# Altium project PCB_Project1.PrjPCB
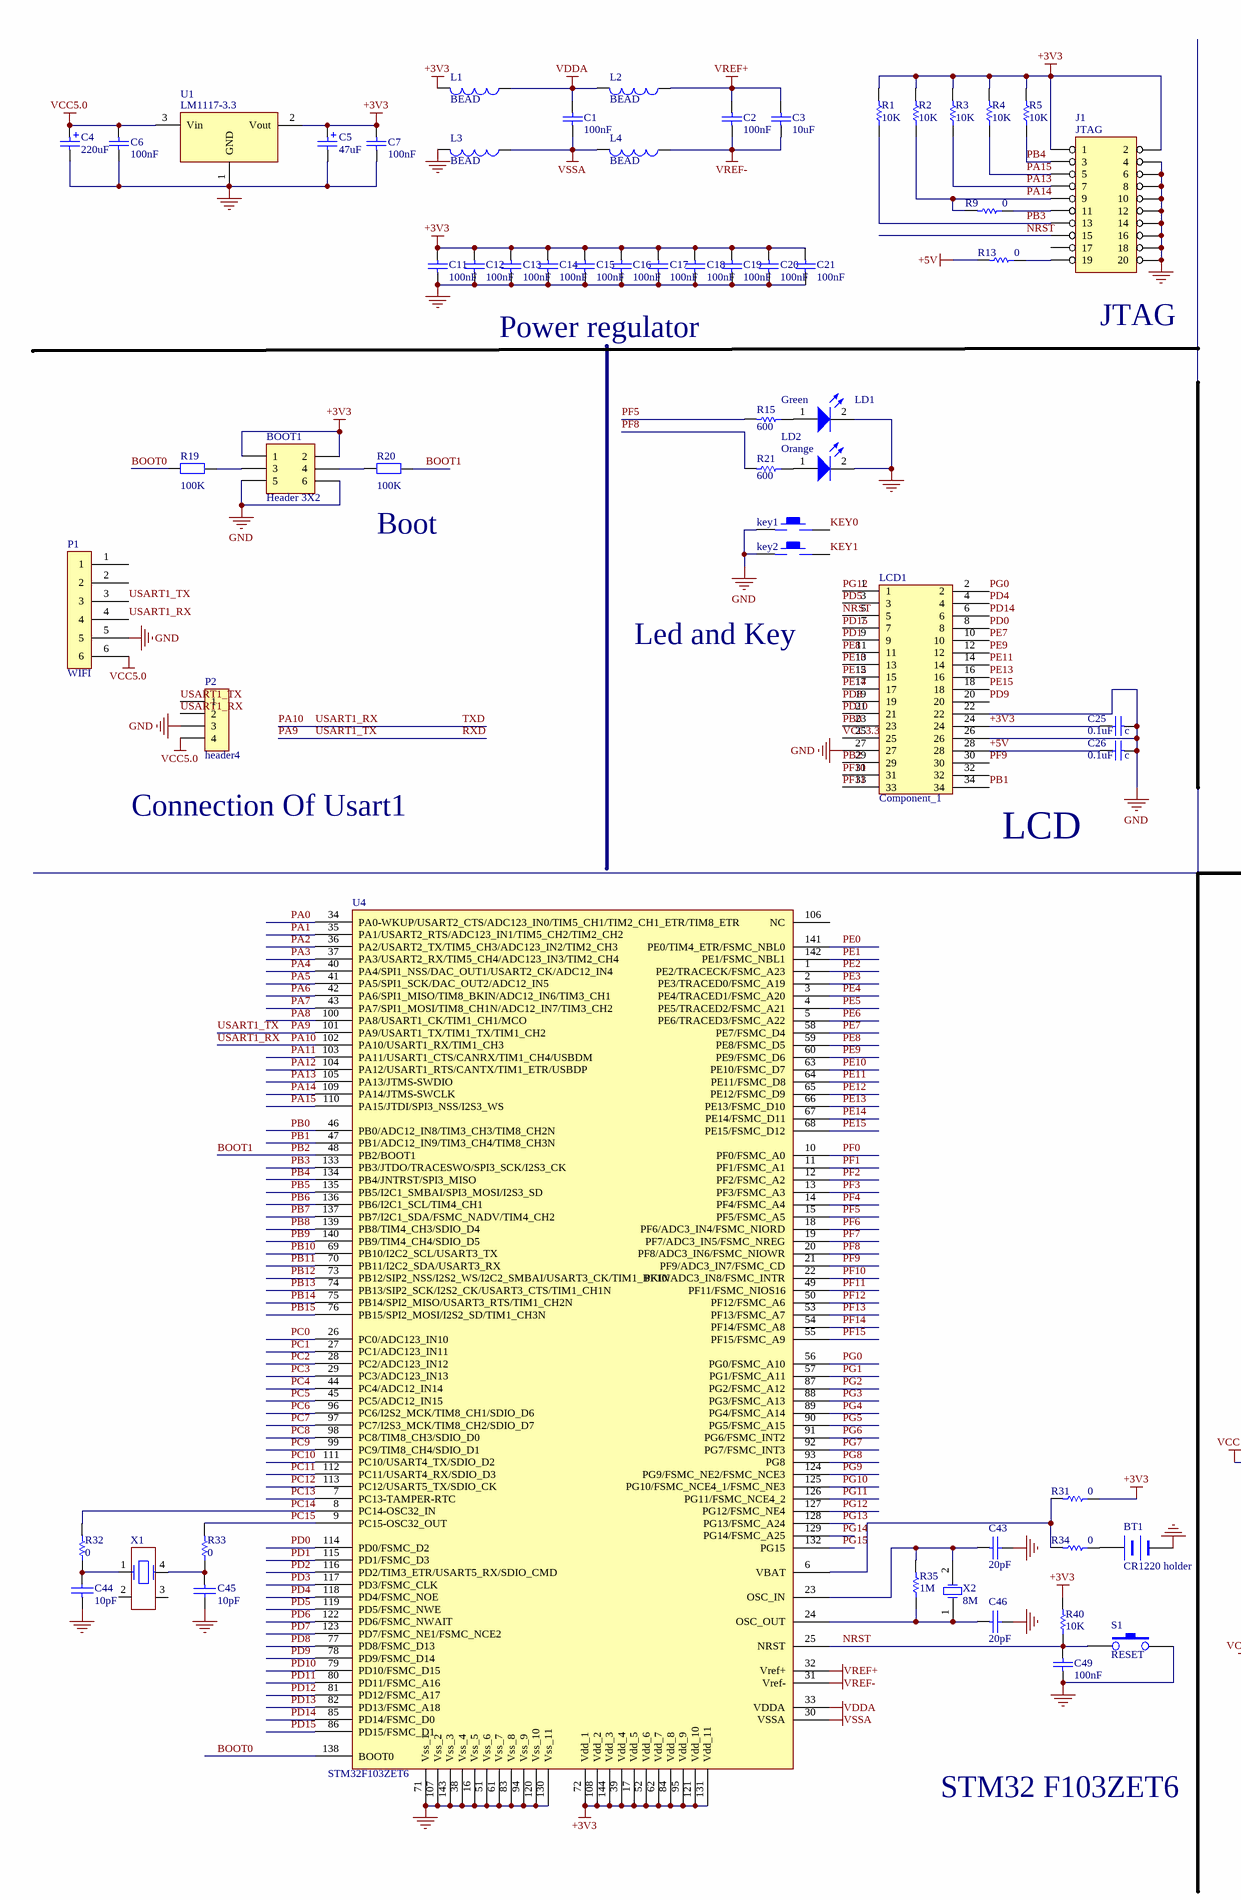
[diagram p0: STM32F103ZET6.SCHDOC, left]
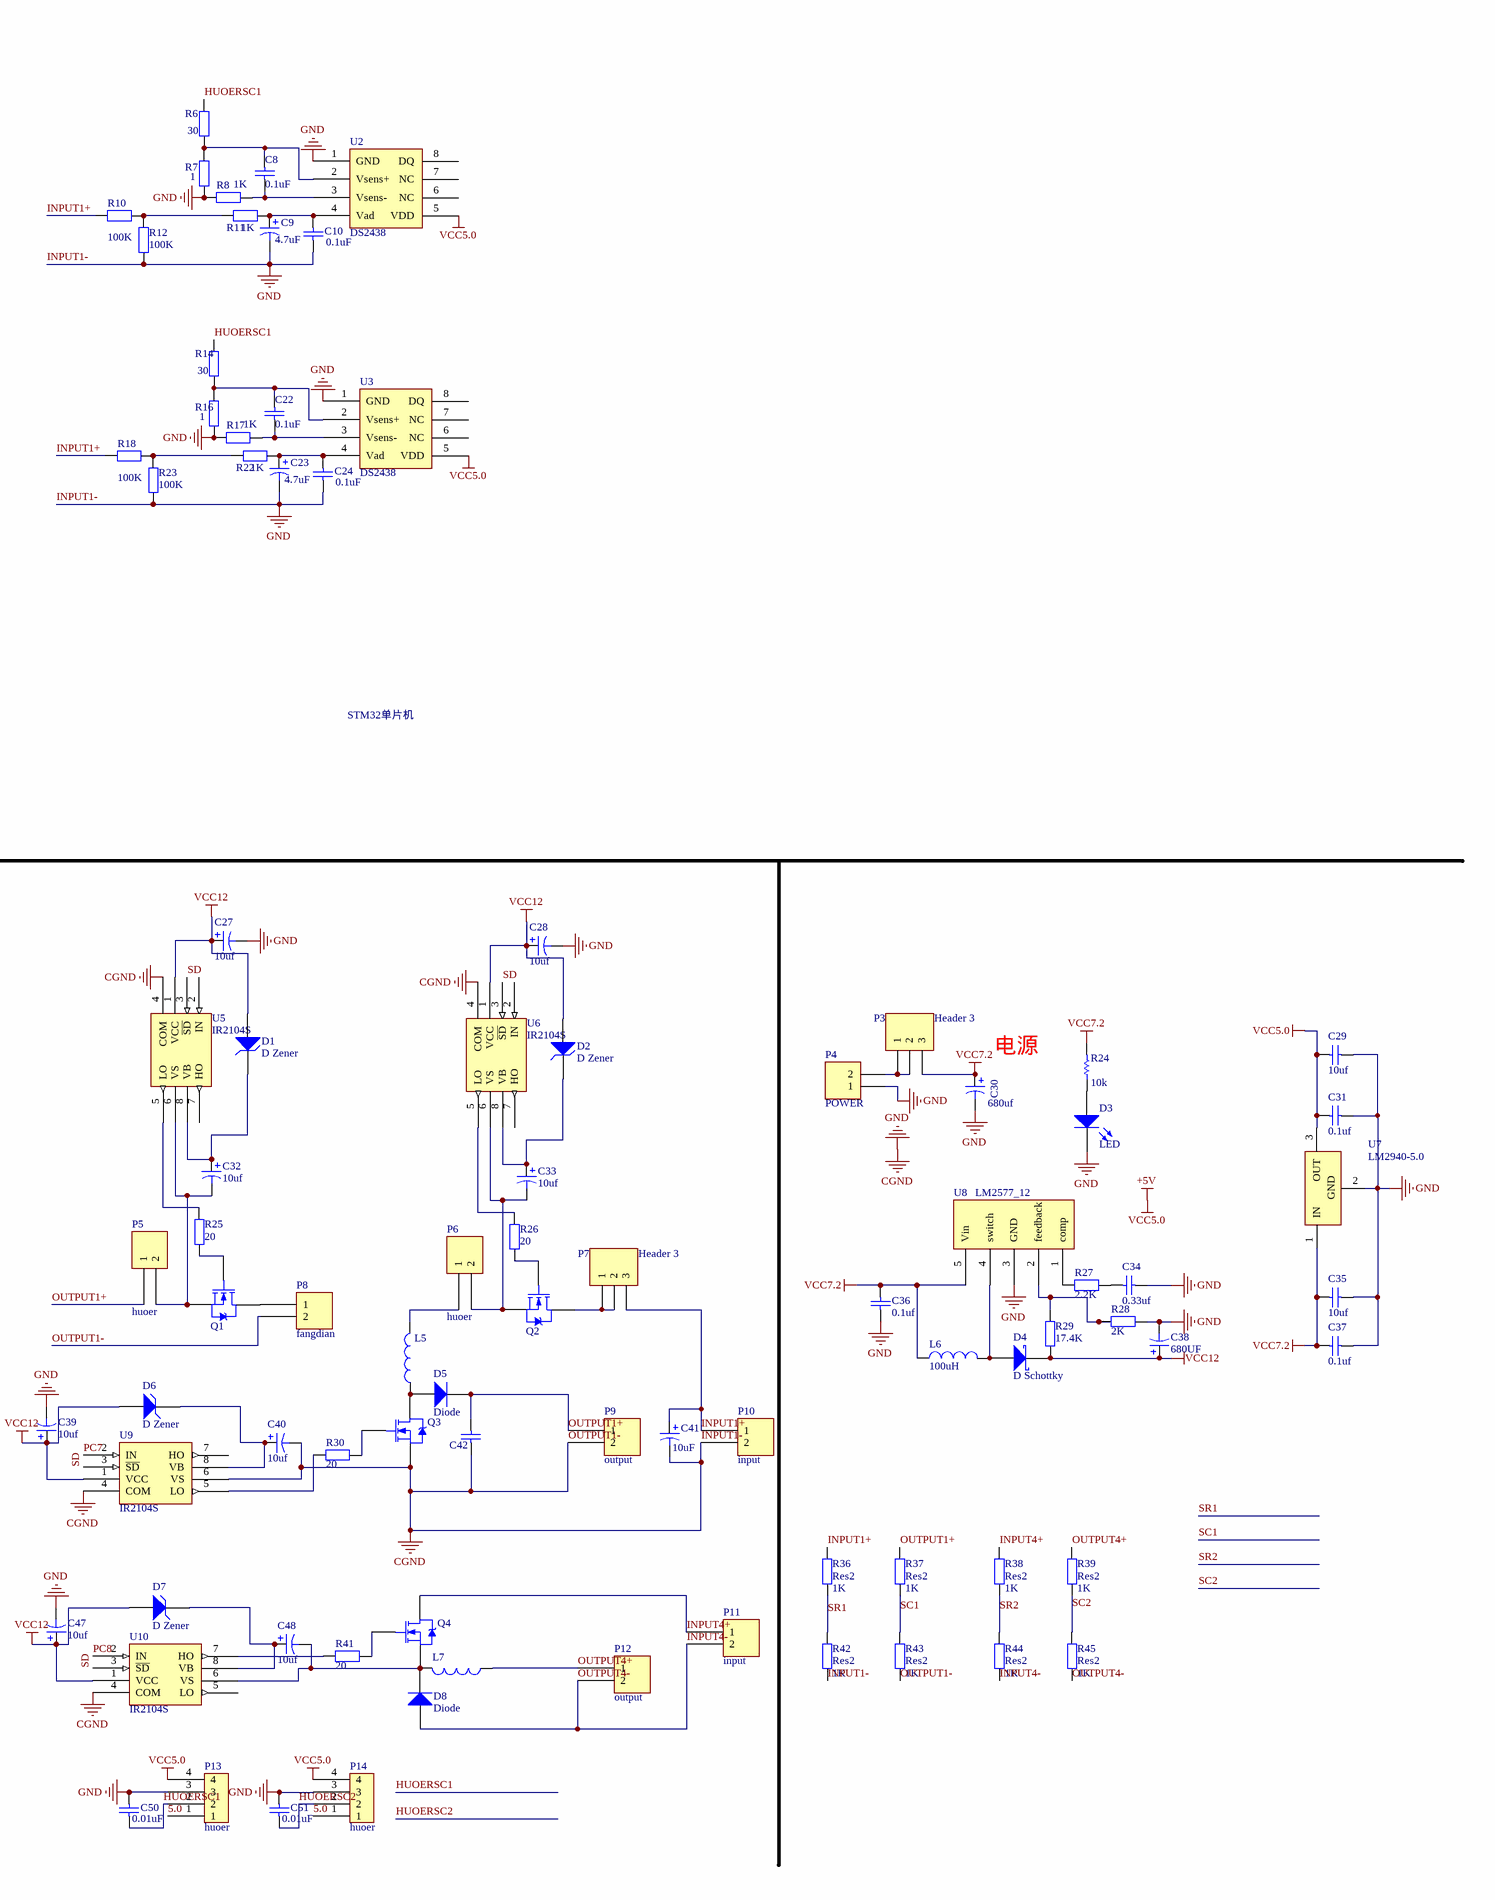
[diagram p1: STM32F103ZET6.SCHDOC, right]
1 sheet, 150 parts. Net scope: global (net labels, ports and power ports of the same name join across sheets).
Board file: STM32F103ZET6.PCBDOC

## Sheet STM32F103ZET6.SCHDOC
size A2

### Parts
BOOT1  Header 3X2  [HDR2X3]
BT1  CR1220 holder  [BAT]
C1  100nF  [0805C]
C2  100nF  [0805C]
C3  10uF  [0805C]
C4  220uF  [0805C]
C5  47uF  [0805C]
C6  100nF  [0805C]
C7  100nF  [0805C]
C8  value 0.1uF  [0805C]
C9  value 4.7uF  [0805C]
C10  value 0.1uF  [0805C]
C11  100nF  [0805C]
C12  100nF  [0805C]
C13  100nF  [0805C]
C14  100nF  [0805C]
C15  100nF  [0805C]
C16  100nF  [0805C]
C17  100nF  [0805C]
C18  100nF  [0805C]
C19  100nF  [0805C]
C20  100nF  [0805C]
C21  100nF  [0805C]
C22  value 0.1uF  [0805C]
C23  value 4.7uF  [0805C]
C24  value 0.1uF  [0805C]
C25  c  value 0.1uF  [0805C]
C26  c  value 0.1uF  [0805C]
C27  value 10uf  [0805C]  (hidden comment: Cap Pol3)
C28  value 10uf  [0805C]  (hidden comment: Cap Pol3)
C29  value 10uf  [0805C]  (hidden comment: Cap)
C30  value 680uf  [cap]  (hidden comment: Cap Pol1)
C31  value 0.1uf  [0805C]  (hidden comment: Cap)
C32  value 10uf  [0805C]  (hidden comment: Cap Pol3)
C33  value 10uf  [0805C]  (hidden comment: Cap Pol3)
C34  value 0.33uf  [0805C]  (hidden comment: Cap Semi)
C35  value 10uf  [0805C]  (hidden comment: Cap)
C36  value 0.1uf  [0805C]  (hidden comment: Cap Semi)
C37  value 0.1uf  [0805C]  (hidden comment: Cap)
C38  value 680UF  [cap]  (hidden comment: Cap Pol3)
C39  value 10uf  [0805C]  (hidden comment: Cap Pol3)
C40  value 10uf  [0805C]  (hidden comment: Cap Pol3)
C41  value 10uF  [0805C]
C42  (no value)  [cap]
C43  20pF  [0805C]
C44  10pF  [0805C]
C45  10pF  [0805C]
C46  20pF  [0805C]
C47  value 10uf  [0805C]  (hidden comment: Cap Pol3)
C48  value 10uf  [0805C]  (hidden comment: Cap Pol3)
C49  100nF  [0805C]
C50  value 0.01uF  [0805C]
C51  value 0.01uF  [0805C]
D1  D Zener  [SMB]
D2  D Zener  [SMB]
D3  LED  [0805D]
D4  D Schottky  [SMB]
D5  Diode  [SMB]
D6  D Zener  [SMB]
D7  D Zener  [SMB]
D8  Diode  [SMB]
J1  JTAG  [JTAG_20PIN]
key1  KEY_M  [key_2pin]  (value not drawn)
key2  KEY_M  [key_2pin]  (value not drawn)
L1  BEAD  [0805R]
L2  BEAD  [0805R]
L3  BEAD  [0805R]
L4  BEAD  [0805R]
L5  (no value)  [L1]
L6  value 100uH  [L1]  (hidden comment: Inductor)
L7  (no value)  [L1]
LCD1  Component_1  [LCD]
LD1  Green  [0805D]
LD2  Orange  [0805D]
P1  WIFI  [wifi]
P2  header4  [HEADER4-PS]
P3  Header 3  [header3-power]
P4  POWER  [dianji]
P5  huoer  [huoer1]
P6  huoer  [huoer1]
P7  Header 3  [header3-power]
P8  fangdian  [duanzi2-5mm]
P9  output  [duanzi2-5mm]
P10  input  [duanzi2-5mm]
P11  input  [duanzi2-5mm]
P12  output  [duanzi2-5mm]
P13  huoer  [huoer]
P14  huoer  [huoer]
Q1  AOD4184  [mos3205]  (value not drawn)
Q2  AOD4184  [mos3205]  (value not drawn)
Q3  AOD4184  [mos3205]  (value not drawn)
Q4  AOD4184  [mos3205]  (value not drawn)
R1  10K  [0805R]
R2  10K  [0805R]
R3  10K  [0805R]
R4  10K  [0805R]
R5  10K  [0805R]
R6  value 30  [0805R]
R7  value 1  [0805R]
R8  value 1K  [0805R]
R9  0  [0805R]
R10  value 100K  [0805R]
R11  value 1K  [0805R]
R12  value 100K  [0805R]
R13  0  [0805R]
R14  value 30  [0805R]
R15  600  [0805R]
R16  value 1  [0805R]
R17  value 1K  [0805R]
R18  value 100K  [0805R]
R19  value 100K  [0805R]  (hidden comment: Res2)
R20  value 100K  [0805R]  (hidden comment: Res2)
R21  600  [0805R]
R22  value 1K  [0805R]
R23  value 100K  [0805R]
R24  value 10k  [0805R]  (hidden comment: Res1)
R25  value 20  [0805R]  (hidden comment: Res2)
R26  value 20  [0805R]  (hidden comment: Res2)
R27  value 2.2K  [0805R]  (hidden comment: Res2)
R28  value 2K  [0805R]  (hidden comment: Res2)
R29  value 17.4K  [0805R]  (hidden comment: Res2)
R30  value 20  [0805R]  (hidden comment: Res2)
R31  0  [0805R]
R32  0  [0805R]
R33  0  [0805R]
R34  0  [0805R]
R35  1M  [0805R]
R36  Res2  value 1K  [0805R]
R37  Res2  value 1K  [0805R]
R38  Res2  value 1K  [0805R]
R39  Res2  value 1K  [0805R]
R40  10K  [0805R]
R41  value 20  [0805R]  (hidden comment: Res2)
R42  Res2  value 1K  [0805R]
R43  Res2  value 1K  [0805R]
R44  Res2  value 1K  [0805R]
R45  Res2  value 1K  [0805R]
S1  RESET  [key_2pin]
U1  LM1117-3.3  [1117]
U2  DS2438  [SOIC_8]
U3  DS2438  [SOIC_8]
U4  STM32F103ZET6  [TQFP144-B]
U5  IR2104S  [SOIC_8]
U6  IR2104S  [SOIC_8]
U7  LM2940-5.0  [TS3B_N]
U8  LM2577_12  [TS5B_N]
U9  IR2104S  [SOIC_8]
U10  IR2104S  [SOIC_8]
X1  MC306-G-06Q-32.768 (manufacturer JFVNY)  [SM8]  (value not drawn)
X2  8M  [XTAL_US]

### Nets
+3V3: BOOT1.1 BOOT1.2 C5.1 C7.1 C11.1 C12.1 C13.1 C14.1 C15.1 C16.1 C17.1 C18.1 C19.1 C20.1 C21.1 C25.1 J1.1 J1.2 L1.2 LCD1.24 R1.2 R2.2 R3.2 R4.2 R5.2 R31.1 R40.2 U1.2(Vout) U4.17(Vdd_5) U4.39(Vdd_4) U4.52(Vdd_6) U4.62(Vdd_7) U4.72(Vdd_1) U4.84(Vdd_8) U4.95(Vdd_9) U4.108(Vdd_2) U4.121(Vdd_10) U4.131(Vdd_11) U4.144(Vdd_3)
+5V: C4.1 C6.1 C26.1 C29.2 C31.2 LCD1.28 P1.6 P2.4 P13.4 P14.4 R13.2 U1.3(Vin) U2.5(VDD) U3.5(VDD) U7.3(OUT)  [also labelled VCC5.0]
INPUT1-: BOOT1.5 BOOT1.6 BT1.2(-) C4.2 C5.2 C6.2 C7.2 C9.2 C10.1 C11.2 C12.2 C13.2 C14.2 C15.2 C16.2 C17.2 C18.2 C19.2 C20.2 C21.2 C23.2 C24.1 C25.2 C26.2 C27.2 C28.2 C29.1 C30.2 C31.1 C34.1 C35.1 C36.1 C37.1 C38.2 C39.2 C40.2 C41.2 C42.1 C43.2 C44.1 C45.2 C46.2 C47.2 C49.1 C50.2 C51.2 D3.2(K) J1.4 J1.6 J1.8 J1.10 J1.12 J1.14 J1.16 J1.18 J1.20 key1.1 key2.1 L3.2 LCD1.22 LCD1.26 LCD1.27 LD1.2(K) LD2.2(K) P1.5 P2.3 P4.1 P8.2 P9.2 P10.2 P13.3 P14.3 Q3.3(S) R7.1 R8.1 R12.1 R16.1 R17.1 R23.1 R28.2 R42.1 R43.1 S1.2 U1.1(GND) U2.1(GND) U3.1(GND) U4.16(Vss_5) U4.38(Vss_4) U4.51(Vss_6) U4.61(Vss_7) U4.71(Vss_1) U4.83(Vss_8) U4.94(Vss_9) U4.107(Vss_2) U4.120(Vss_10) U4.130(Vss_11) U4.143(Vss_3) U5.4(COM) U6.4(COM) U7.2(GND) U8.3(GND) U9.4(COM) U9.6(VS) U10.4(COM)  [also labelled CGND, GND, OUTPUT1-]
VCC7.2: C30.1 C35.2 C36.2 C37.2 L6.1 P3.3 R24.2 U7.1(IN) U8.5(Vin)
VCC12: C27.1 C28.1 C38.1 C39.1 C47.1 D1.1(A) D2.1(A) D4.2(K) D6.1(A) D7.1(A) R29.1 U5.1(VCC) U6.1(VCC) U9.1(VCC) U10.1(VCC)
VDDA: C1.1 L1.1 L2.2 U4.33(VDDA)
VREF+: C2.1 C3.1 L2.1 U4.32(Vref+)
VREF-: C2.2 C3.2 L4.1 U4.31(Vref-)
VSSA: C1.2 L3.1 L4.2 U4.30(VSSA)
5.0: P13.1 P14.1
BOOT0: R19.1 U4.138(BOOT0)
BOOT1: LCD1.29 R20.2 U4.48(PB2/BOOT1)  [also labelled PB2]
HUOERSC1: C50.1 P13.2 R6.2 R14.2
HUOERSC2: C51.1 P14.2
INPUT1+: C41.1 P7.3 P10.1 R10.2 R18.2 R36.2
INPUT4+: P11.1 Q4.2(D) R38.2
INPUT4-: D8.1(A) P11.2 P12.2 R44.1 R45.1  [also labelled OUTPUT4-]
KEY0: key1.2
KEY1: key2.2
NRST: C49.2 J1.15 LCD1.5 R40.1 S1.1 U4.25(NRST)
OUTPUT1+: C42.2 D5.2(K) P5.1 P9.1 R37.2
OUTPUT4+: L7.1 P12.1 R39.2
PA0: U4.34(PA0-WKUP/USART2_CTS/ADC123_IN0/TIM5_CH1/TIM2_CH1_ETR/TIM8_ETR)
PA1: U4.35(PA1/USART2_RTS/ADC123_IN1/TIM5_CH2/TIM2_CH2)
PA2: U4.36(PA2/USART2_TX/TIM5_CH3/ADC123_IN2/TIM2_CH3)
PA3: U4.37(PA3/USART2_RX/TIM5_CH4/ADC123_IN3/TIM2_CH4)
PA4: U4.40(PA4/SPI1_NSS/DAC_OUT1/USART2_CK/ADC12_IN4)
PA5: U4.41(PA5/SPI1_SCK/DAC_OUT2/ADC12_IN5)
PA6: U4.42(PA6/SPI1_MISO/TIM8_BKIN/ADC12_IN6/TIM3_CH1)
PA7: U4.43(PA7/SPI1_MOSI/TIM8_CH1N/ADC12_IN7/TIM3_CH2)
PA8: U4.100(PA8/USART1_CK/TIM1_CH1/MCO)
PA9: P1.3 P2.1 U4.101(PA9/USART1_TX/TIM1_TX/TIM1_CH2)  [also labelled RXD, USART1_TX]
PA10: P1.4 P2.2 U4.102(PA10/USART1_RX/TIM1_CH3)  [also labelled TXD, USART1_RX]
PA11: U4.103(PA11/USART1_CTS/CANRX/TIM1_CH4/USBDM)
PA12: U4.104(PA12/USART1_RTS/CANTX/TIM1_ETR/USBDP)
PA13: J1.7 R3.1 U4.105(PA13/JTMS-SWDIO)
PA14: J1.9 R2.1 R9.2 U4.109(PA14/JTMS-SWCLK)
PA15: J1.5 R4.1 U4.110(PA15/JTDI/SPI3_NSS/I2S3_WS)
PB0: LCD1.23 U4.46(PB0/ADC12_IN8/TIM3_CH3/TIM8_CH2N)
PB1: LCD1.34 U4.47(PB1/ADC12_IN9/TIM3_CH4/TIM8_CH3N)
PB3: J1.13 R1.1 U4.133(PB3/JTDO/TRACESWO/SPI3_SCK/I2S3_CK)
PB4: J1.3 R5.1 U4.134(PB4/JNTRST/SPI3_MISO)
PB5: U4.135(PB5/I2C1_SMBAI/SPI3_MOSI/I2S3_SD)
PB6: U4.136(PB6/I2C1_SCL/TIM4_CH1)
PB7: U4.137(PB7/I2C1_SDA/FSMC_NADV/TIM4_CH2)
PB8: U4.139(PB8/TIM4_CH3/SDIO_D4)
PB9: U4.140(PB9/TIM4_CH4/SDIO_D5)
PB10: U4.69(PB10/I2C2_SCL/USART3_TX)
PB11: U4.70(PB11/I2C2_SDA/USART3_RX)
PB12: U4.73(PB12/SIP2_NSS/I2S2_WS/I2C2_SMBAI/USART3_CK/TIM1_BKIN)
PB13: U4.74(PB13/SIP2_SCK/I2S2_CK/USART3_CTS/TIM1_CH1N)
PB14: U4.75(PB14/SPI2_MISO/USART3_RTS/TIM1_CH2N)
PB15: U4.76(PB15/SPI2_MOSI/I2S2_SD/TIM1_CH3N)
PC0: U4.26(PC0/ADC123_IN10)
PC1: U4.27(PC1/ADC123_IN11)
PC2: U4.28(PC2/ADC123_IN12)
PC3: U4.29(PC3/ADC123_IN13)
PC4: U4.44(PC4/ADC12_IN14)
PC5: U4.45(PC5/ADC12_IN15)
PC6: U4.96(PC6/I2S2_MCK/TIM8_CH1/SDIO_D6)
PC7: U4.97(PC7/I2S3_MCK/TIM8_CH2/SDIO_D7) U9.2(IN)
PC8: U4.98(PC8/TIM8_CH3/SDIO_D0) U10.2(IN)
PC9: U4.99(PC9/TIM8_CH4/SDIO_D1)
PC10: U4.111(PC10/USART4_TX/SDIO_D2)
PC11: U4.112(PC11/USART4_RX/SDIO_D3)
PC12: U4.113(PC12/USART5_TX/SDIO_CK)
PC13: U4.7(PC13-TAMPER-RTC)
PC14: R32.2 U4.8(PC14-OSC32_IN)
PC15: R33.2 U4.9(PC15-OSC32_OUT)
PD0: LCD1.8 U4.114(PD0/FSMC_D2)
PD1: LCD1.9 U4.115(PD1/FSMC_D3)
PD2: U4.116(PD2/TIM3_ETR/USART5_RX/SDIO_CMD)
PD3: U4.117(PD3/FSMC_CLK)
PD4: LCD1.4 U4.118(PD4/FSMC_NOE)
PD5: LCD1.3 U4.119(PD5/FSMC_NWE)
PD6: U4.122(PD6/FSMC_NWAIT)
PD7: U4.123(PD7/FSMC_NE1/FSMC_NCE2)
PD8: LCD1.19 U4.77(PD8/FSMC_D13)
PD9: LCD1.20 U4.78(PD9/FSMC_D14)
PD10: LCD1.21 U4.79(PD10/FSMC_D15)
PD11: U4.80(PD11/FSMC_A16)
PD12: U4.81(PD12/FSMC_A17)
PD13: U4.82(PD13/FSMC_A18)
PD14: LCD1.6 U4.85(PD14/FSMC_D0)
PD15: LCD1.7 U4.86(PD15/FSMC_D1)
PE0: U4.141(PE0/TIM4_ETR/FSMC_NBL0)
PE1: U4.142(PE1/FSMC_NBL1)
PE2: U4.1(PE2/TRACECK/FSMC_A23)
PE3: U4.2(PE3/TRACED0/FSMC_A19)
PE4: U4.3(PE4/TRACED1/FSMC_A20)
PE5: U4.4(PE5/TRACED2/FSMC_A21)
PE6: U4.5(PE6/TRACED3/FSMC_A22)
PE7: LCD1.10 U4.58(PE7/FSMC_D4)
PE8: LCD1.11 U4.59(PE8/FSMC_D5)
PE9: LCD1.12 U4.60(PE9/FSMC_D6)
PE10: LCD1.13 U4.63(PE10/FSMC_D7)
PE11: LCD1.14 U4.64(PE11/FSMC_D8)
PE12: LCD1.15 U4.65(PE12/FSMC_D9)
PE13: LCD1.16 U4.66(PE13/FSMC_D10)
PE14: LCD1.17 U4.67(PE14/FSMC_D11)
PE15: LCD1.18 U4.68(PE15/FSMC_D12)
PF0: U4.10(PF0/FSMC_A0)
PF1: U4.11(PF1/FSMC_A1)
PF2: U4.12(PF2/FSMC_A2)
PF3: U4.13(PF3/FSMC_A3)
PF4: U4.14(PF4/FSMC_A4)
PF5: R15.2 U4.15(PF5/FSMC_A5)
PF6: U4.18(PF6/ADC3_IN4/FSMC_NIORD)
PF7: U4.19(PF7/ADC3_IN5/FSMC_NREG)
PF8: R21.2 U4.20(PF8/ADC3_IN6/FSMC_NIOWR)
PF9: LCD1.30 U4.21(PF9/ADC3_IN7/FSMC_CD)
PF10: LCD1.31 U4.22(PF10/ADC3_IN8/FSMC_INTR)
PF11: LCD1.33 U4.49(PF11/FSMC_NIOS16)
PF12: U4.50(PF12/FSMC_A6)
PF13: U4.53(PF13/FSMC_A7)
PF14: U4.54(PF14/FSMC_A8)
PF15: U4.55(PF15/FSMC_A9)
PG0: LCD1.2 U4.56(PG0/FSMC_A10)
PG1: U4.57(PG1/FSMC_A11)
PG2: U4.87(PG2/FSMC_A12)
PG3: U4.88(PG3/FSMC_A13)
PG4: U4.89(PG4/FSMC_A14)
PG5: U4.90(PG5/FSMC_A15)
PG6: U4.91(PG6/FSMC_INT2)
PG7: U4.92(PG7/FSMC_INT3)
PG8: U4.93(PG8)
PG9: U4.124(PG9/FSMC_NE2/FSMC_NCE3)
PG10: U4.125(PG10/FSMC_NCE4_1/FSMC_NE3)
PG11: U4.126(PG11/FSMC_NCE4_2)
PG12: LCD1.1 U4.127(PG12/FSMC_NE4)
PG13: U4.128(PG13/FSMC_A24)
PG14: U4.129(PG14/FSMC_A25)
PG15: U4.132(PG15)
SC1: R37.1 R43.2
SC2: R39.1 R45.2
SD: U5.3(~{SD}) U6.3(~{SD}) U9.3(~{SD}) U10.3(~{SD})
SR1: R36.1 R42.2
SR2: R38.1 R44.2
VCC3.3: LCD1.25
NetBOOT1_3: BOOT1.3 R19.2
NetBOOT1_4: BOOT1.4 R20.1
NetBT1_1: BT1.1(+) R34.1
NetC8_1: C8.1 R8.2 U2.3(Vsens-)
NetC8_2: C8.2 R6.1 R7.2 U2.2(Vsens+)
NetC9_1: C9.1 C10.2 R11.2 U2.4(Vad)
NetC22_1: C22.1 R17.2 U3.3(Vsens-)
NetC22_2: C22.2 R14.1 R16.2 U3.2(Vsens+)
NetC23_1: C23.1 C24.2 R22.2 U3.4(Vad)
NetC32_1: C32.1 D1.2(K) U5.8(VB)
NetC32_2: C32.2 P5.2 Q1.3(S) U5.6(VS)
NetC33_1: C33.1 D2.2(K) U6.8(VB)
NetC33_2: C33.2 P6.2 Q2.3(S) U6.6(VS)
NetC34_2: C34.2 R27.2
NetC40_1: C40.1 D6.2(K) U9.8(VB)
NetC43_1: C43.1 R35.2 U4.23(OSC_IN) X2.2(OSC2)
NetC44_2: C44.2 R32.1 X1.1
NetC45_1: C45.1 R33.1 X1.4
NetC46_1: C46.1 R35.1 U4.24(OSC_OUT) X2.1(OSC1)
NetC48_1: C48.1 D7.2(K) U10.8(VB)
NetC48_2: C48.2 D8.2(K) L7.2 Q4.3(S) U10.6(VS)
NetD3_1: D3.1(A) R24.1
NetD4_1: D4.1(A) L6.2 U8.4(switch)
NetD5_1: D5.1(A) L5.1 Q3.2(D)
NetJ1_11: J1.11 R9.1
NetJ1_19: J1.19 R13.1
NetL5_2: L5.2 P6.1
NetLD1_1: LD1.1(A) R15.1
NetLD2_1: LD2.1(A) R21.1
NetP3_1: P3.1 P3.2 P4.2
NetP7_1: P7.1 P7.2 Q2.2(D)
NetP8_1: P8.1 Q1.2(D)
NetQ1_1: Q1.1(G) R25.2
NetQ2_1: Q2.1(G) R26.2
NetQ3_1: Q3.1(G) R30.2
NetQ4_1: Q4.1(G) R41.2
NetR10_1: R10.1 R11.1 R12.2
NetR18_1: R18.1 R22.1 R23.2
NetR25_1: R25.1 U5.5(LO)
NetR26_1: R26.1 U6.5(LO)
NetR27_1: R27.1 U8.1(comp)
NetR28_1: R28.1 R29.2 U8.2(feedback)
NetR30_1: R30.1 U9.5(LO)
NetR31_2: R31.2 R34.2 U4.6(VBAT)
NetR41_1: R41.1 U10.7(HO)

Not connected (* = marked no-connect by the designer): J1 17; LCD1 32; P1 1 2; U2 6(NC) 7(NC) 8(DQ); U3 6(NC) 7(NC) 8(DQ); U4 106(NC); U5 2(IN) 7(HO); U6 2(IN) 7(HO); U9 7(HO); U10 5(LO); X1 2 3

### Notes on the sheet
- Power regulator
- (near J1) JTAG
- (near R20) Boot
- Led and Key
- STM32单片机
- Connection Of Usart1
- LCD
- (near C30) 电源
- STM32 F103ZET6

### Library data of the parts
BOOT1 = Header 3X2: Header, 3-Pin, Dual row; LatestRevisionDate: *; LatestRevisionNote: *; Publisher: *
BT1 = BATTERY
C1-C3 C6 C7 = Cap: Capacitor; Value: 10nF; Published: 8-Jun-2000; Revision: July-2002: Re-released for DXP Platform.; Publisher: Altium Limited
C4 C5 = Cap Pol1: Polarized Capacitor (Radial); Value: 10uF; Published: 8-Jun-2000; Revision: July-2002: Re-released for DXP Platform.; Publisher: Altium Limited
C8 C10 C22 C24-C26 C29 C31 C35 C37 C42 C50 C51 = Cap: Capacitor; Published: 8-Jun-2000; LatestRevisionDate: 17-Jul-2002; LatestRevisionNote: Re-released for DXP Platform.; PackageReference: RAD-0.3; Publisher: Altium Limited
  C8 C10 C22 C24-C26 C42 C50 C51: PackageDescription: Radial Cap, Thru-Hole; 2 Leads; 0.3 in Pin Spacing
C9 C23 C30 C41 = Cap Pol1: Polarized Capacitor (Radial); Published: 8-Jun-2000; LatestRevisionDate: 17-Jul-2002; LatestRevisionNote: Re-released for DXP Platform.; PackageReference: RB7.6-15; Publisher: Altium Limited
  C9 C23 C41: PackageDescription: Polarized Capacitor (Radial); 2 Leads
C11-C21 C43-C46 = CAP: Capacitor
  C11-C21: Published: 8-Jun-2000; Revision: July-2002: Re-released for DXP Platform.; Publisher: Altium Limited; Value: 100nF
C27 C28 C32 C33 C38-C40 C47 C48 = Cap Pol3: Polarized Capacitor (Surface Mount); Published: 8-Jun-2000; PackageReference: C0805; Publisher: Altium Limited
  C27 C28 C32 C33 C39 C40 C47 C48: LatestRevisionDate: 29-May-2009; LatestRevisionNote: IPC-7351 Footprint Added.; PackageDescription: Chip Capacitor
  C38: LatestRevisionDate: 17-Jul-2002; LatestRevisionNote: Re-released for DXP Platform.
C34 C36 = Cap Semi: Capacitor (Semiconductor SIM Model); Published: 8-Jun-2000; LatestRevisionDate: 29-May-2009; LatestRevisionNote: IPC-7351 Footprint Added.; PackageReference: C1206; Publisher: Altium Limited; PackageDescription: Chip Capacitor
C49 = CAP: Capacitor; Value: 100pF; Published: 8-Jun-2000; Revision: July-2002: Re-released for DXP Platform.; Publisher: Altium Limited
D1 D2 D6 D7 = D Zener: Zener Diode; Published: 8-Jun-2000; LatestRevisionDate: 17-Jul-2002; LatestRevisionNote: Re-released for DXP Platform.; PackageReference: DIODE-0.7; Publisher: Altium Limited
D3 LD1 LD2 = LED2: Typical RED, GREEN, YELLOW, AMBER GaAs LED; Published: 8-Jun-2000; Publisher: Altium Limited
  D3: LatestRevisionDate: 17-Jul-2002; LatestRevisionNote: Re-released for DXP Platform.; PackageVersion: Feb-2002; PackageReference: 3.2X1.6X1.1
  LD1 LD2: Revision: July-2002: Re-released for DXP Platform.
D4 = D Schottky: Schottky Diode; Published: 8-Jun-2000; LatestRevisionDate: 17-Jul-2002; LatestRevisionNote: Re-released for DXP Platform.; PackageReference: SMB; Publisher: Altium Limited; PackageDescription: DO-214-AA/SMB; 2 C-Bend Leads; Body 5.3 x 3.6 mm, inc. leads (LxW); Code_JEDEC: DO-214-AA
D5 D8 = Diode: Default Diode; Published: 8-Jun-2000; LatestRevisionDate: 17-Jul-2002; LatestRevisionNote: Re-released for DXP Platform.; PackageVersion: Sep-1996; PackageReference: SMC; Publisher: Altium Limited; PackageDescription: DO-214-AB/SMC; 2 C-Bend Leads; Body 7.9 x 5.9 mm, inc. leads (LxW); Code_JEDEC: DO-214-AB
J1 = HEADER 10X2
L1-L4 = Inductor: Value: 100uH; Published: 8-Jun-2000; Revision: July-2002: Re-released for DXP Platform.; Publisher: Altium Limited
L5-L7 = Inductor: Code_IEC: 1005; Published: 8-Jun-2000; PackageReference: 0402-A; Publisher: Altium Limited; Code_JEITA: 0402
  L5 L7: LatestRevisionDate: 29-May-2009; LatestRevisionNote: IPC-7351 Footprint Added.; PackageDescription: Chip Inductor
  L6: LatestRevisionDate: 17-Jul-2002; LatestRevisionNote: Re-released for DXP Platform.
P3 P7 = Header 3: Header, 3-Pin; LatestRevisionDate: 17-Jul-2002; LatestRevisionNote: Re-released for DXP Platform.; Publisher: Altium Limited
P4 = Header 2: Header, 2-Pin; LatestRevisionDate: 17-Jul-2002; LatestRevisionNote: Re-released for DXP Platform.; Publisher: Altium Limited
P5 P6 P8-P12 = Header2
Q1-Q4 = NMOS-2: N-Channel Power MOSFET; Note: Pin 2 is electrically connected to pin 4.; Published: 8-Jun-2000; LatestRevisionDate: 17-Jul-2002; LatestRevisionNote: Re-released for DXP Platform.; DatasheetVersion: PD-9.814; PackageReference: TO-220AB; Publisher: Altium Limited; ComponentLink1Description: Manufacturer Link; ComponentLink1URL: http://www.irf.com/
R1-R5 R9 R13 R15 R21 R31-R35 = Res1: Resistor; Value: 1K; Published: 8-Jun-2000; Revision: July-2002: Re-released for DXP Platform.; Publisher: Altium Limited
R6-R8 R10-R12 R14 R16-R20 R22 R23 R25-R30 R36-R39 R41-R45 = Res2: Resistor; Published: 8-Jun-2000; LatestRevisionDate: 17-Jul-2002; LatestRevisionNote: Re-released for DXP Platform.; PackageReference: AXIAL-0.4; Publisher: Altium Limited
  R6-R8 R10-R12 R14 R16-R18 R22 R23 R25-R30 R36-R39 R41-R45: PackageDescription: Axial Device, Thru-Hole; 2 Leads; 0.4 in Pin Spacing
R24 = Res1: Resistor; Published: 8-Jun-2000; LatestRevisionDate: 17-Jul-2002; LatestRevisionNote: Re-released for DXP Platform.; PackageReference: AXIAL-0.3; Publisher: Altium Limited
R40 = res1: Resistor; Value: 1K; Published: 8-Jun-2000; Revision: July-2002: Re-released for DXP Platform.; Publisher: Altium Limited
S1 = SW-PB
U1 = VOLTREG1
U2 U3 = huoer
U7 = LM2940T-5.0: 1A Low Dropout Regulator; Manufacturer: National Semiconductor; CompType: LDO IC; PackageTopMarking: NSUZXYTTE#*LM2940T*-5.0 P+; PowerWise: N; Published: 4-Dec-2008; DatasheetVersion: Jan-2007; PackageVersion: revL, Jan-1992; PackageReference: T03B; Publisher: Altium Limited; PackageDescription: TO-220, Molded, 3 Lead, Straight; PartNumber: LM2940T-5.0; RoHS: O; PinCount: 3; DigiKeyPartNumber: LM2940T-5.0-ND; ComponentLink1Description: LM2940 Datasheet; ComponentLink1URL: http://www.national.com/ds/LM/LM2940.pdf; ComponentLink2Description: LM2940 Web Page; ComponentLink2URL: http://www.national.com/pf/LM/LM2940.html; ComponentLink3Description: T03B Package Page; ComponentLink3URL: http://www.national.com/packaging/folders/t03b.html
X1 = MC306
X2 = XTAL: Crystal Oscillator; Published: *; LatestRevisionDate: *; LatestRevisionNote: *; Publisher: *